# EAGLE schematic schematic (EAGLE 9.6.2)
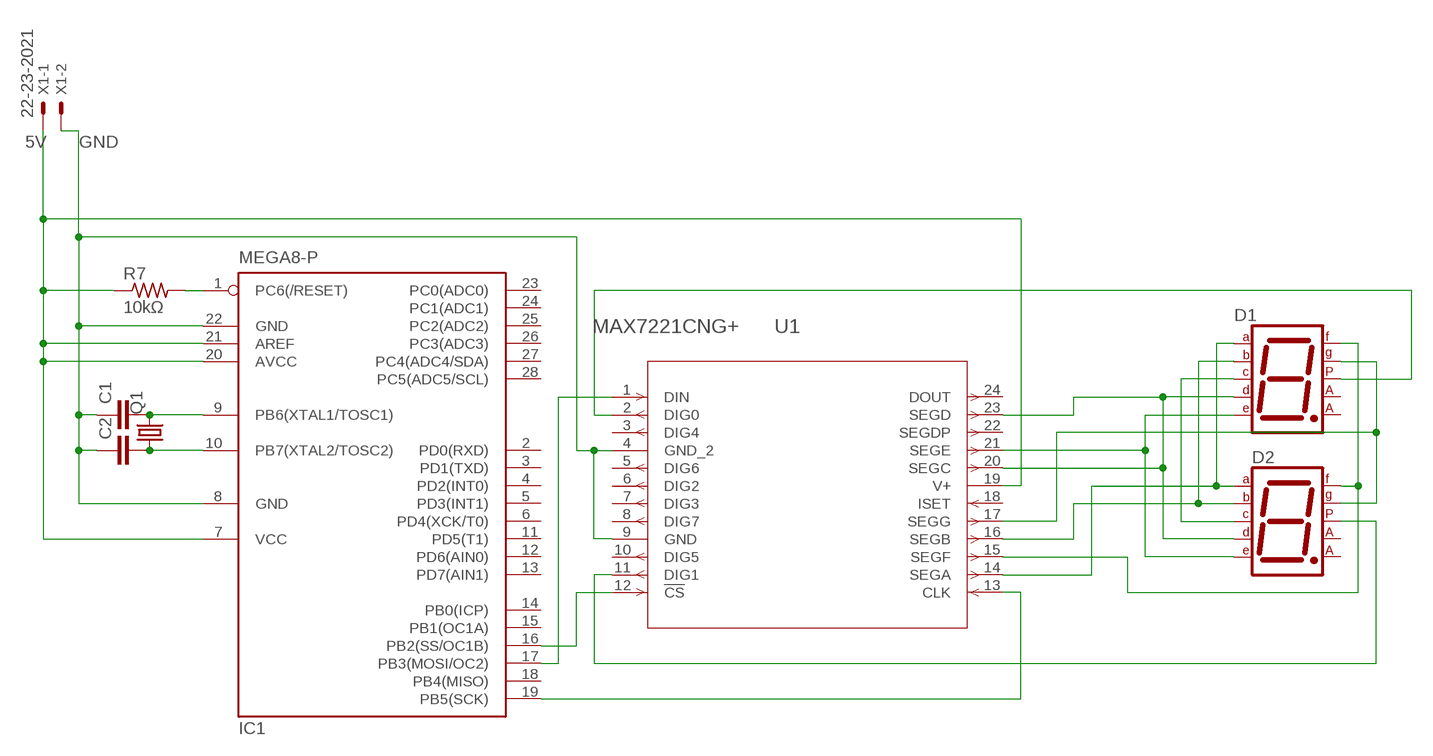
[diagram p0: schematic, sheet 1]

## Parts
C1  C2,5-3  [C2.5-3]
C2  C2,5-3  [C2.5-3]
D1  7SEG-CA  [7SEG-13]
D2  7SEG-CA  [7SEG-13]
IC1  MEGA8-P  [DIL28-3]
Q1  CRYSTALHC18U-V  [HC18U-V]
R7  10kΩ  R-US_0204/2V  [0204V]
U1  MAX7221CNG+  [21-0043D_24_MXM]
X1  22-23-2021  [22-23-2021]

## Nets
5V: IC1.7(VCC) IC1.20(AVCC) IC1.21(AREF) R7.1 U1.19(V+) X1.1
GND: C1.1 C2.1 IC1.8(GND) IC1.22(GND) U1.4(GND_2) U1.9(GND) X1.2
N$1: D1.7(A) D2.7(A) U1.14(SEGA)
N$2: D1.9(F) D2.9(F) U1.15(SEGF)
N$3: D1.6(B) D2.6(B) U1.16(SEGB)
N$4: D1.4(C) D2.4(C)
N$5: D1.2(D) D2.2(D) U1.20(SEGC) U1.23(SEGD)
N$6: D1.10(G) D2.10(G) U1.17(SEGG)
N$7: D1.1(E) D2.1(E) U1.21(SEGE)
N$8: D1.5(DP) U1.2(DIG0)
N$9: D2.5(DP) U1.11(DIG1)
N$11: IC1.19(PB5(SCK)) U1.13(CLK)
N$12: IC1.16(PB2(SS/OC1B)) U1.12(!CS)
N$13: IC1.17(PB3(MOSI/OC2)) U1.1(DIN)
N$14: IC1.1(PC6(/RESET)) R7.2
N$15: C1.2 IC1.9(PB6(XTAL1/TOSC1)) Q1.2
N$16: C2.2 IC1.10(PB7(XTAL2/TOSC2)) Q1.1
Unconnected: D1.3(CA1) D1.8(CA2) D2.3(CA1) D2.8(CA2) IC1.2(PD0(RXD)) IC1.3(PD1(TXD)) IC1.4(PD2(INT0)) IC1.5(PD3(INT1)) IC1.6(PD4(XCK/T0)) IC1.11(PD5(T1)) IC1.12(PD6(AIN0)) IC1.13(PD7(AIN1)) IC1.14(PB0(ICP)) IC1.15(PB1(OC1A)) IC1.18(PB4(MISO)) IC1.23(PC0(ADC0)) IC1.24(PC1(ADC1)) IC1.25(PC2(ADC2)) IC1.26(PC3(ADC3)) IC1.27(PC4(ADC4/SDA)) IC1.28(PC5(ADC5/SCL)) U1.3(DIG4) U1.5(DIG6) U1.6(DIG2) U1.7(DIG3) U1.8(DIG7) U1.10(DIG5) U1.18(ISET) U1.22(SEGDP) U1.24(DOUT)

## Library data of the parts
C1 C2 = capacitor-wima:C: CAPACITOR naming: grid - package width
D1 D2 = special:7SEG-CA: 7-segment DISPLAY single anode, 13 mm
IC1 = atmel:MEGA8-P: MICROCONTROLLER 8 Kbytes FLASH, 1 kbytes SRAM, 512 bytes EEPROM, USART, 4-channel 10 bit ADC, 2-channel 8 bit ADC Pin compatible with Atmega48, ATMega88, ATMega168 Source: avr.lbr; OC_FARNELL: unknown; OC_NEWARK: unknown
Q1 = crystal:CRYSTAL: CRYSTAL; OC_FARNELL: unknown; OC_NEWARK: unknown
R7 = rcl:R-US_: RESISTOR, American symbol; SPICEPREFIX: R
U1 = maxim:MAX7221CNG+; COPYRIGHT: Copyright (C) 2022 Ultra Librarian. All rights reserved.; DIGI-KEY_PART_NUMBER_1: MAX7221CNG+-ND; MANUFACTURER_PART_NUMBER: MAX7221CNG+; MFR_NAME: Maxim Integrated Products
X1 = con-molex:22-23-2021: .100" (2.54mm) Center Header - 2 Pin; MF: MOLEX; MPN: 22-23-2021; OC_FARNELL: 1462926; OC_NEWARK: 25C3832